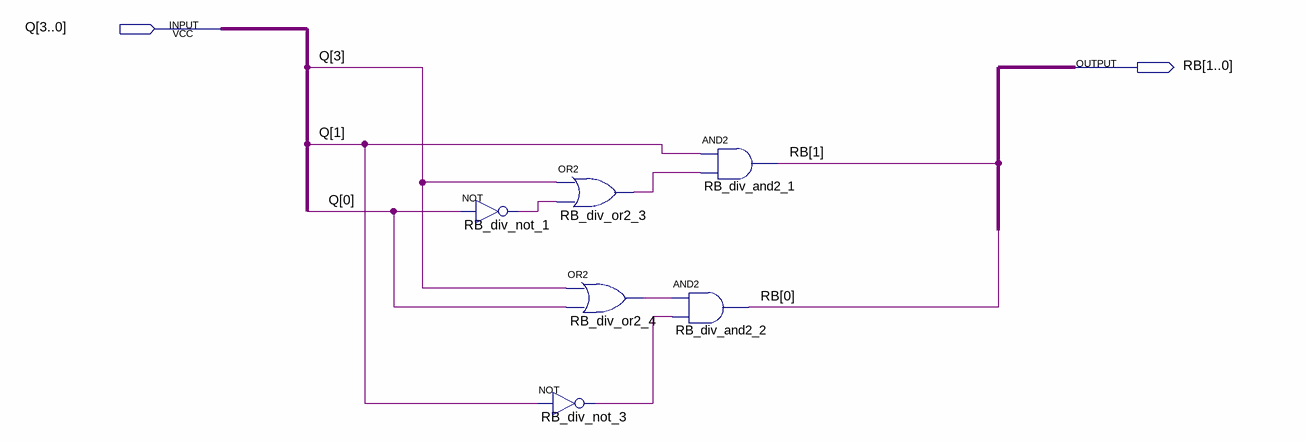
[diagram p0: schematic sheet]
// Quartus schematic RB_Division.bdf as structural Verilog: 6 symbols, 2 pins
module RB_Division (
  input  [3:0] Q,
  output [1:0] RB
);

  wire RB_div_not_1_out, RB_div_not_3_out, RB_div_or2_3_out, RB_div_or2_4_out;

  not RB_div_not_1 (RB_div_not_1_out, Q[0]);
  or RB_div_or2_3 (RB_div_or2_3_out, Q[3], RB_div_not_1_out);
  or RB_div_or2_4 (RB_div_or2_4_out, Q[3], Q[0]);
  not RB_div_not_3 (RB_div_not_3_out, Q[1]);
  and RB_div_and2_1 (RB[1], Q[1], RB_div_or2_3_out);
  and RB_div_and2_2 (RB[0], RB_div_or2_4_out, RB_div_not_3_out);
endmodule
